# Altium schematic sheet 01_Top_Level.SchDoc
size B; SheetNumber: 1; SheetTotal: 6
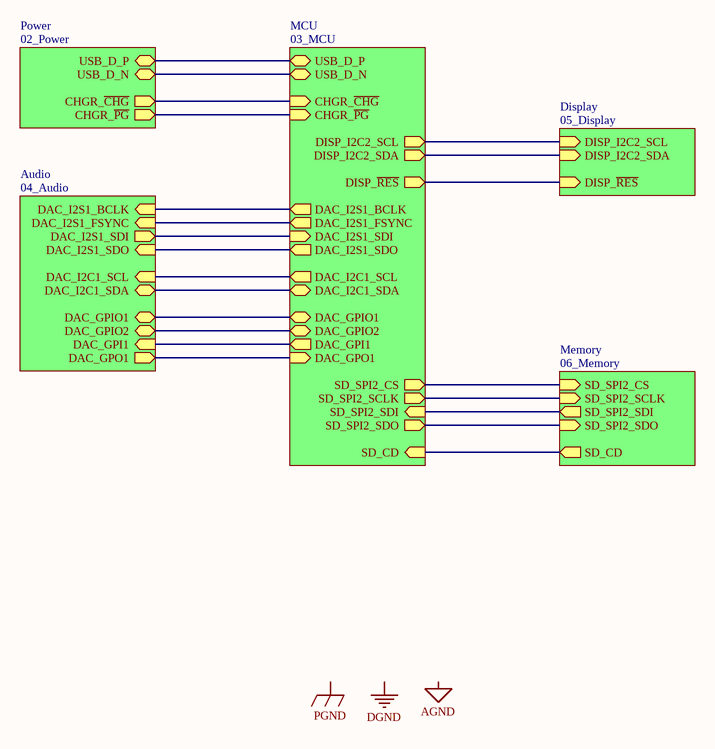
[diagram p0: 01_Top_Level.SchDoc]

## Sub-sheets
Audio = 04_Audio: DAC_I2S1_BCLK (in), DAC_I2S1_FSYNC (in), DAC_I2S1_SDI (out), DAC_I2S1_SDO (in), DAC_I2C1_SCL (in), DAC_I2C1_SDA (bidir), DAC_GPIO1 (bidir), DAC_GPIO2 (bidir), DAC_GPI1 (in), DAC_GPO1 (out)
Display = 05_Display: DISP_I2C2_SDA (in), DISP_I2C2_SCL (in), DISP_~{RES} (in)
MCU = 03_MCU: USB_D_P (bidir), USB_D_N (bidir), CHGR_~{CHG} (in), CHGR_~{PG} (in), DISP_I2C2_SDA (out), DISP_I2C2_SCL (out), SD_SPI2_CS (out), SD_SPI2_SCLK (out), SD_SPI2_SDI (in), SD_SPI2_SDO (out), SD_CD (in), DISP_~{RES} (out), DAC_GPO1 (in), DAC_GPI1 (out), DAC_GPIO2 (bidir), DAC_GPIO1 (bidir), DAC_I2C1_SDA (bidir), DAC_I2C1_SCL (out), DAC_I2S1_SDO (out), DAC_I2S1_SDI (in), DAC_I2S1_FSYNC (out), DAC_I2S1_BCLK (out)
Memory = 06_Memory: SD_SPI2_CS (in), SD_CD (out), SD_SPI2_SCLK (in), SD_SPI2_SDI (out), SD_SPI2_SDO (in)
Power = 02_Power: CHGR_~{PG} (out), CHGR_~{CHG} (out), USB_D_N (bidir), USB_D_P (bidir)

## Nets
(unnamed): sheet MCU/USB_D_P, sheet Power/USB_D_P
(unnamed): sheet MCU/USB_D_N, sheet Power/USB_D_N
(unnamed): sheet MCU/CHGR_~{CHG}, sheet Power/CHGR_~{CHG}
(unnamed): sheet MCU/CHGR_~{PG}, sheet Power/CHGR_~{PG}
(unnamed): sheet MCU/DISP_I2C2_SDA, sheet Display/DISP_I2C2_SDA
(unnamed): sheet MCU/DISP_I2C2_SCL, sheet Display/DISP_I2C2_SCL
(unnamed): sheet MCU/SD_SPI2_CS, sheet Memory/SD_SPI2_CS
(unnamed): sheet MCU/SD_SPI2_SCLK, sheet Memory/SD_SPI2_SCLK
(unnamed): sheet MCU/SD_SPI2_SDI, sheet Memory/SD_SPI2_SDI
(unnamed): sheet MCU/SD_SPI2_SDO, sheet Memory/SD_SPI2_SDO
(unnamed): sheet MCU/SD_CD, sheet Memory/SD_CD
(unnamed): sheet MCU/DISP_~{RES}, sheet Display/DISP_~{RES}
(unnamed): sheet MCU/DAC_GPO1, sheet Audio/DAC_GPO1
(unnamed): sheet MCU/DAC_GPI1, sheet Audio/DAC_GPI1
(unnamed): sheet MCU/DAC_GPIO2, sheet Audio/DAC_GPIO2
(unnamed): sheet MCU/DAC_GPIO1, sheet Audio/DAC_GPIO1
(unnamed): sheet MCU/DAC_I2C1_SDA, sheet Audio/DAC_I2C1_SDA
(unnamed): sheet MCU/DAC_I2C1_SCL, sheet Audio/DAC_I2C1_SCL
(unnamed): sheet MCU/DAC_I2S1_SDO, sheet Audio/DAC_I2S1_SDO
(unnamed): sheet MCU/DAC_I2S1_SDI, sheet Audio/DAC_I2S1_SDI
(unnamed): sheet MCU/DAC_I2S1_FSYNC, sheet Audio/DAC_I2S1_FSYNC
(unnamed): sheet MCU/DAC_I2S1_BCLK, sheet Audio/DAC_I2S1_BCLK

## Notes on the sheet
- Labels drawn without touching a wire or pin: AGND, DGND, PGND